# Altium schematic sheet display.SchDoc
size A
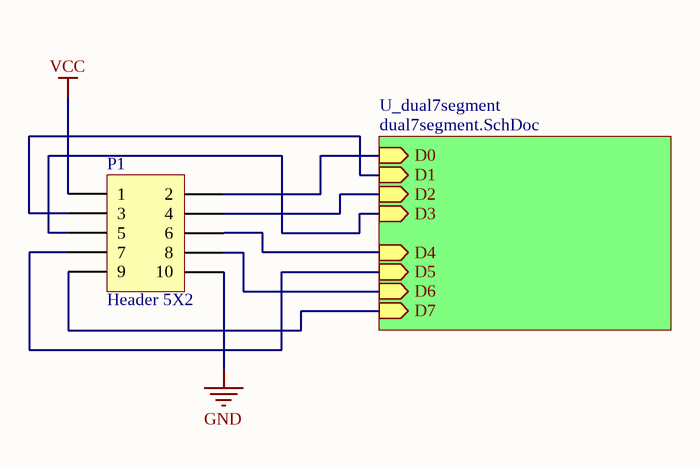
[diagram p0: display.SchDoc]

## Parts
P1  Header 5X2  [HDR2X5]

## Sub-sheets
U_dual7segment = dual7segment.SchDoc: D0 (in), D1 (in), D2 (in), D3 (in), D4 (in), D5 (in), D6 (in), D7 (in)

## Nets
GND: P1.10
VCC: P1.1
NetP1_2: P1.2 ; sheet U_dual7segment/D0
NetP1_3: P1.3 ; sheet U_dual7segment/D1
NetP1_4: P1.4 ; sheet U_dual7segment/D2
NetP1_5: P1.5 ; sheet U_dual7segment/D3
NetP1_6: P1.6 ; sheet U_dual7segment/D4
NetP1_7: P1.7 ; sheet U_dual7segment/D5
NetP1_8: P1.8 ; sheet U_dual7segment/D6
NetP1_9: P1.9 ; sheet U_dual7segment/D7

## Library data of the parts
P1 = Header 5X2: Header, 5-Pin, Dual row; LatestRevisionDate: 17-Jul-2002; LatestRevisionNote: Re-released for DXP Platform.; Publisher: Altium Limited